# Altium schematic sheet Motor_Drive_2.SchDoc
size B; PageSetup: Record=PageOptions|CenterHorizontal=True|CenterVertical=True|PrintScale=1.09|XCorrection=1.00|YCorrection=1.00|PrintKind=1|BorderSize=5000000|LeftOffset=0|BottomOffset=0|Orientation=2|PaperLength=1000|PaperWidth=1000|Scale=100|PaperSource=261|PrintQuality=600|MediaType=1|DitherType=10|PaperKind=11x17|PrintScaleMode=1
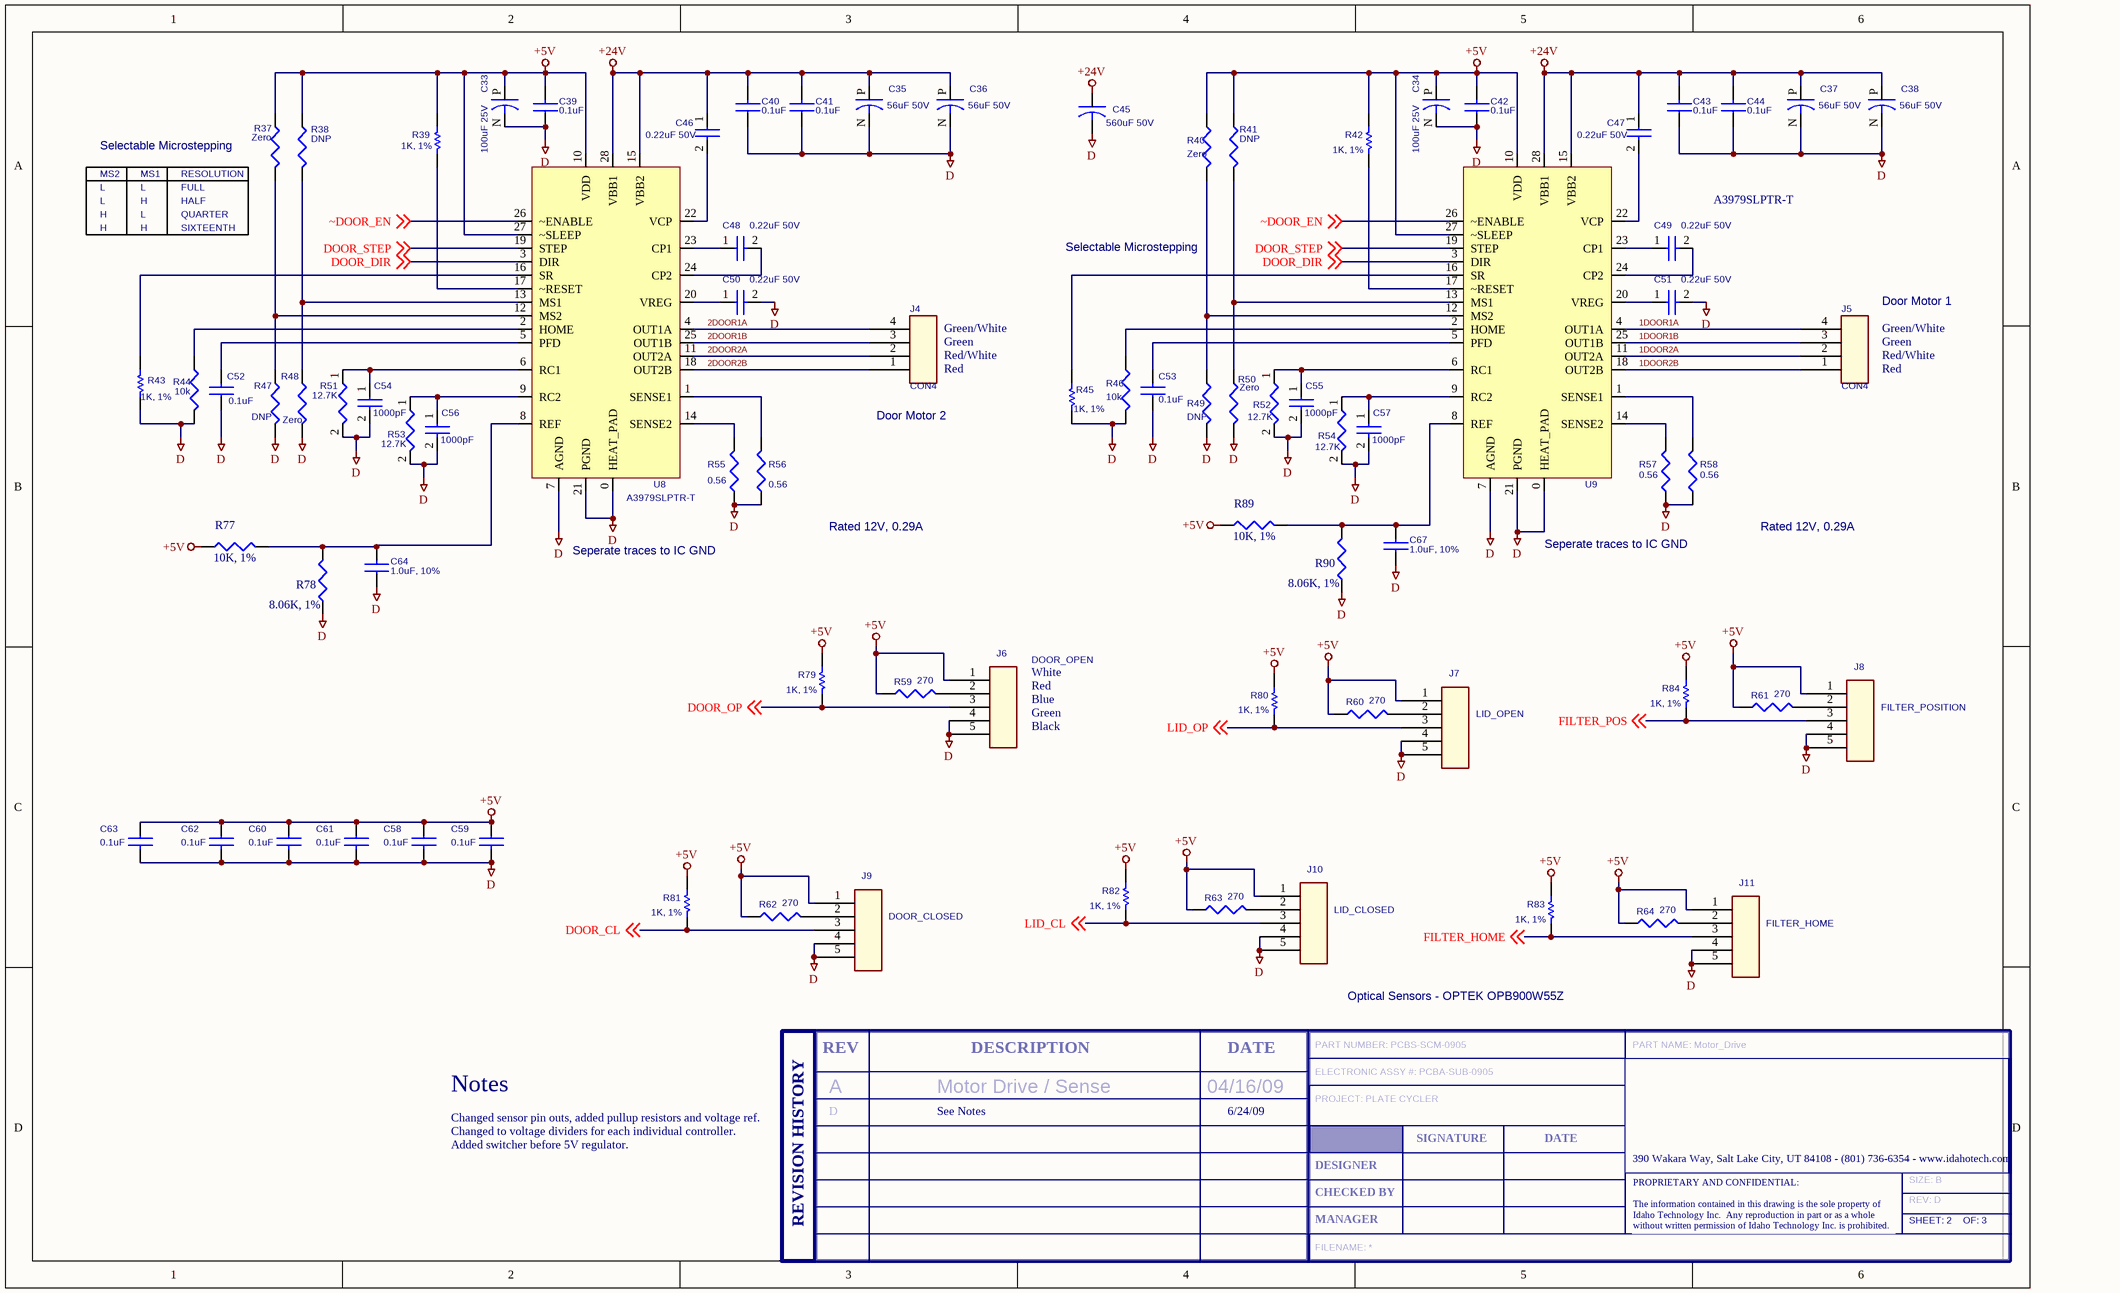
[diagram p0: Motor_Drive_2.SchDoc]

## Parts
C33  100uF 25V  [SM/CT_7360]
C34  100uF 25V  [SM/CT_7360]
C35  56uF 50V  [CPCYL/D.250/LS.100/.031]
C36  56uF 50V  [CPCYL/D.250/LS.100/.031]
C37  56uF 50V  [CPCYL/D.250/LS.100/.031]
C38  56uF 50V  [CPCYL/D.250/LS.100/.031]
C39  0.1uF  [SM/C_0603]
C40  0.1uF  [SM/C_0603]
C41  0.1uF  [SM/C_0603]
C42  0.1uF  [SM/C_0603]
C43  0.1uF  [SM/C_0603]
C44  0.1uF  [SM/C_0603]
C45  560uF 50V  [ELECT FS RADIAL 90, 25mm length x 12.5mm diameter - vertical]
C46  0.22uF 50V  [SM/C_0603]
C47  0.22uF 50V  [SM/C_0603]
C48  0.22uF 50V  [SM/C_0603]
C49  0.22uF 50V  [SM/C_0603]
C50  0.22uF 50V  [SM/C_0603]
C51  0.22uF 50V  [SM/C_0603]
C52  0.1uF  [SM/C_0603]
C53  0.1uF  [SM/C_0603]
C54  1000pF  [SM/C_0603]
C55  1000pF  [SM/C_0603]
C56  1000pF  [SM/C_0603]
C57  1000pF  [SM/C_0603]
C58  0.1uF  [SM/C_0603]
C59  0.1uF  [SM/C_0603]
C60  0.1uF  [SM/C_0603]
C61  0.1uF  [SM/C_0603]
C62  0.1uF  [SM/C_0603]
C63  0.1uF  [SM/C_0603]
C64  1.0uF, 10%  [SM/C_0603]
C67  1.0uF, 10%  [SM/C_0603]
J4  CON4  [MOLEX4]
J5  CON4  [MOLEX4]
J6  DOOR_OPEN  [POLCON.100/LOCKING/5]
J7  LID_OPEN  [POLCON.100/LOCKING/5]
J8  FILTER_POSITION  [POLCON.100/LOCKING/5]
J9  DOOR_CLOSED  [POLCON.100/LOCKING/5]
J10  LID_CLOSED  [POLCON.100/LOCKING/5]
J11  FILTER_HOME  [POLCON.100/LOCKING/5]
R37  Zero  [SM/R_0603]
R38  DNP  [SM/R_0603]  (no BOM)
R39  value 1K, 1%  [0603]  (hidden comment: Res1)
R40  Zero  [SM/R_0603]
R41  DNP  [SM/R_0603]  (no BOM)
R42  value 1K, 1%  [0603]  (hidden comment: Res1)
R43  value 1K, 1%  [0603]  (hidden comment: Res1)
R44  10k  [SM/R_0603]
R45  value 1K, 1%  [0603]  (hidden comment: Res1)
R46  10k  [SM/R_0603]
R47  DNP  [SM/R_0603]  (no BOM)
R48  Zero  [SM/R_0603]
R49  DNP  [SM/R_0603]  (no BOM)
R50  Zero  [SM/R_0603]
R51  12.7K  [SM/R_0603]
R52  12.7K  [SM/R_0603]
R53  12.7K  [SM/R_0603]
R54  12.7K  [SM/R_0603]
R55  0.56  [SM/R_2512]
R56  0.56  [SM/R_2512]
R57  0.56  [SM/R_2512]
R58  0.56  [SM/R_2512]
R59  270  [SM/R_0603]
R60  270  [SM/R_0603]
R61  270  [SM/R_0603]
R62  270  [SM/R_0603]
R63  270  [SM/R_0603]
R64  270  [SM/R_0603]
R77  10K, 1%  [SM/R_0603]
R78  8.06K, 1%  [SM/R_0603]
R79  value 1K, 1%  [0603]  (hidden comment: Res1)
R80  value 1K, 1%  [0603]  (hidden comment: Res1)
R81  value 1K, 1%  [0603]  (hidden comment: Res1)
R82  value 1K, 1%  [0603]  (hidden comment: Res1)
R83  value 1K, 1%  [0603]  (hidden comment: Res1)
R84  value 1K, 1%  [0603]  (hidden comment: Res1)
R89  10K, 1%  [SM/R_0603]
R90  8.06K, 1%  [SM/R_0603]
T??  SIZE: B  REV: D  PART NUMBER: PCBS-SCM-0905  PART NAME: Motor_Drive  ELECTRONIC ASSY #: PCBA-SUB-0905  PROJECT: PLATE CYCLER  SHEET: 2  OF: 3  (hidden comment: ITI Title Block, A Size)  (graphical)
U8  Manufacturer P/N: A3979SLPTR-T  [28-TSSOP_W_HEATPAD]  (hidden comment: STEPPER_CNTRL)
U9  Manufacturer P/N: A3979SLPTR-T  [28-TSSOP_W_HEATPAD]  (hidden comment: STEPPER_CNTRL)

## Nets
+5V: C33.P C34.P C39.2 C42.2 C58.1 C59.1 C60.1 C61.1 C62.1 C63.1 J6.1 J7.1 J8.1 J9.1 J10.1 J11.1 R37.1 R38.1 R39.2 R40.1 R41.1 R42.2 R59.1 R60.1 R61.1 R62.1 R63.1 R64.1 R77.1 R79.2 R80.2 R81.2 R82.2 R83.2 R84.2 R89.1 U8.10(VDD) U8.27(~SLEEP) U9.10(VDD) U9.27(~SLEEP)
+24V: C35.P C36.P C37.P C38.P C40.2 C41.2 C43.2 C44.2 C45.1 C46.1 C47.1 U8.15(VBB2) U8.28(VBB1) U9.15(VBB2) U9.28(VBB1)
D: C33.N C34.N C35.N C36.N C37.N C38.N C39.1 C40.1 C41.1 C42.1 C43.1 C44.1 C45.2 C50.2 C51.2 C52.1 C53.1 C54.2 C55.2 C56.2 C57.2 C58.2 C59.2 C60.2 C61.2 C62.2 C63.2 C64.1 C67.1 J6.4 J6.5 J7.4 J7.5 J8.4 J8.5 J9.4 J9.5 J10.4 J10.5 J11.4 J11.5 R43.1 R44.2 R45.1 R46.2 R47.2 R48.2 R49.2 R50.2 R51.2 R52.2 R53.2 R54.2 R55.1 R56.1 R57.1 R58.1 R78.1 R90.1 U8.0(HEAT_PAD) U8.7(AGND) U8.21(PGND) U9.0(HEAT_PAD) U9.7(AGND) U9.21(PGND)
1DOOR1A: J5.4 U9.4(OUT1A)
1DOOR1B: J5.3 U9.25(OUT1B)
1DOOR2A: J5.2 U9.11(OUT2A)
1DOOR2B: J5.1 U9.18(OUT2B)
2DOOR1A: J4.4 U8.4(OUT1A)
2DOOR1B: J4.3 U8.25(OUT1B)
2DOOR2A: J4.2 U8.11(OUT2A)
2DOOR2B: J4.1 U8.18(OUT2B)
DOOR_CL: J9.3 R81.1 ; off-sheet DOOR_CL
DOOR_DIR: U8.3(DIR) U9.3(DIR) ; off-sheet DOOR_DIR
DOOR_OP: J6.3 R79.1 ; off-sheet DOOR_OP
DOOR_STEP: U8.19(STEP) U9.19(STEP) ; off-sheet DOOR_STEP
FILTER_HOME: J11.3 R83.1 ; off-sheet FILTER_HOME
FILTER_POS: J8.3 R84.1 ; off-sheet FILTER_POS
LID_CL: J10.3 R82.1 ; off-sheet LID_CL
LID_OP: J7.3 R80.1 ; off-sheet LID_OP
~DOOR_EN: U8.26(~ENABLE) U9.26(~ENABLE) ; off-sheet ~DOOR_EN
NetC46_2: C46.2 U8.22(VCP)
NetC47_2: C47.2 U9.22(VCP)
NetC48_1: C48.1 U8.23(CP1)
NetC48_2: C48.2 U8.24(CP2)
NetC49_1: C49.1 U9.23(CP1)
NetC49_2: C49.2 U9.24(CP2)
NetC50_1: C50.1 U8.20(VREG)
NetC51_1: C51.1 U9.20(VREG)
NetC52_2: C52.2 U8.5(PFD)
NetC53_2: C53.2 U9.5(PFD)
NetC54_1: C54.1 R51.1 U8.6(RC1)
NetC55_1: C55.1 R52.1 U9.6(RC1)
NetC56_1: C56.1 R53.1 U8.9(RC2)
NetC57_1: C57.1 R54.1 U9.9(RC2)
NetC64_2: C64.2 R77.2 R78.2 U8.8(REF)
NetC67_2: C67.2 R89.2 R90.2 U9.8(REF)
NetJ6_2: J6.2 R59.2
NetJ7_2: J7.2 R60.2
NetJ8_2: J8.2 R61.2
NetJ9_2: J9.2 R62.2
NetJ10_2: J10.2 R63.2
NetJ11_2: J11.2 R64.2
NetR37_2: R37.2 R47.1 U8.12(MS2)
NetR38_2: R38.2 R48.1 U8.13(MS1)
NetR39_1: R39.1 U8.17(~RESET)
NetR40_2: R40.2 R49.1 U9.12(MS2)
NetR41_2: R41.2 R50.1 U9.13(MS1)
NetR42_1: R42.1 U9.17(~RESET)
NetR43_2: R43.2 U8.16(SR)
NetR44_1: R44.1 U8.2(HOME)
NetR45_2: R45.2 U9.16(SR)
NetR46_1: R46.1 U9.2(HOME)
NetR55_2: R55.2 U8.14(SENSE2)
NetR56_2: R56.2 U8.1(SENSE1)
NetR57_2: R57.2 U9.14(SENSE2)
NetR58_2: R58.2 U9.1(SENSE1)

## Notes on the sheet
- (near R37) Selectable Microstepping
- MS2
- L
- H
- MS1
- RESOLUTION
- FULL
- HALF
- QUARTER
- SIXTEENTH
- Selectable Microstepping
- (near J4) Red
- (near J4) Red/White
- (near J4) Green
- (near J4) Green/White
- (near J5) Door Motor 1
- (near J5) Red
- (near J5) Red/White
- (near J5) Green
- (near J5) Green/White
- (near J4) Door Motor 2
- Seperate traces to IC GND
- Rated 12V, 0.29A
- (near J6) White
- (near J6) Red
- (near J6) Blue
- (near J6) Green
- (near J6) Black
- Optical Sensors - OPTEK OPB900W55Z
- Notes
- A
- Motor Drive / Sense
- 04/16/09
- Changed sensor pin outs, added pullup resistors and voltage ref.
- Changed to voltage dividers for each individual controller.
- Added switcher before 5V regulator.
- D
- See Notes
- 6/24/09
- (in symbol ITI A-size Title Block and Rev Table) REV; DESCRIPTION; DATE; SIGNATURE; 390 Wakara Way, Salt Lake City, UT 84108 - (801) 736-6354 - www.idahotech.com; DESIGNER; CHECKED BY; REVISION HISTORY; MANAGER; PROPRIETARY AND CONFIDENTIAL: / The information contained in this drawing is the sole property of / Idaho Technology Inc.  Any reproduction in part or as a whole / without written permission of Idaho Technology Inc. is prohibited.

## Library data of the parts
C33 C34 = CAP_1: CAPACITOR TANT 100UF 25V 20% SMD; Manufacturer: Kemet; Manufacturer P/N: T510E107M025AT E050; Vendor: Digikey; Vendor P/N: 399-3989-1-ND
C35-C38 = CAP_1: CAP 56UF 50V ELECT FC RADIAL; Manufacturer: PANASONIC; Manufacturer P/N: EEU-FC1H560; Vendor P/N: P10322-ND; Vendor: Digikey
C39-C44 C52 C53 = CAP NP_Dup1: CAP CER .10UF 50V X7R 0603; Manufacturer: Taiyo Yuden; Manufacturer P/N: UMK107B7104KA-T; Vendor: Digikey; Vendor P/N: 587-1243-1-ND
C45 = CAP: CAP 560UF 50V ELECT FC RADIAL; Manufacturer P/N: EEU-FC1H561; Manufacturer: Panasonic; Vendor P/N: P11261-ND; Vendor: Digikey
C46-C51 = CAP NP_1: CAP CER .22UF 50V Y5V 0603; Manufacturer: Murata Electronics North America; Manufacturer P/N: GRM188F51H224ZA01D; Vendor P/N: 490-1569-1-ND; Vendor: Digikey
C54-C57 = CAP NP_1: CAP 1000PF 50V CERAMIC X7R 0603; Manufacturer: Panasonic - ECG; Manufacturer P/N: ECJ-1VB1H102K; Vendor P/N: PCC1772CT-ND; Vendor: Digikey
C58-C63 = CAP NP_Dup1: CAP CER .10UF 50V X7R 0603; Manufacturer P/N: UMK107B7104KA-T; Manufacturer: Taiyo Yuden; Vendor P/N: 587-1243-1-ND; Vendor: Digikey
C64 C67 = CAP NP_Dup1: CAP CER 1.0UF 10V X5R 10% 0603; Manufacturer: TDK Corporation; Manufacturer P/N: C1608X5R1A105K; Vendor: DIGIKEY; Vendor P/N: 445-1321-1-ND
J4 J5 = CON4: CONN HEADER 4POS .100 VERT GOLD; Manufacturer: Molex/Waldom Electronics Corp; Manufacturer P/N: 70543-0003; Vendor P/N: WM4802-ND; Vendor: Digikey
J6-J11 = CON5: CONN HEADER 5POS .100 VERT GOLD; Manufacturer: Molex; Manufacturer P/N: 70543-0004; Vendor: Digikey; Vendor P/N: WM4803-ND
R37 R38 R40 R41 R47-R50 = R: RES 0.0 OHM 1/10W 5% 0603 SMD; Manufacturer P/N: MCR03EZPJ000; Manufacturer: ROHM SEMICONDUCTOR; Vendor P/N: RHM0.0GCT-ND; Vendor: DIGIKEY; Price: 0.069
R39 R43 R45 R79-R81 = Res1: RES 1.00K OHM 1/10W 1% 0603 SMD; Manufacturer: PANASONIC - ECG; Manufacturer P/N: ERJ-3EKF1001V; Vendor: DIGIKEY; Vendor P/N: P1.00KHCT-ND; IT P/N: N/A; Price: 0.73
R42 R82-R84 = Res1: RES 1.00K OHM 1/10W 1% 0603 SMD; Manufacturer: PANASONIC; Manufacturer P/N: ERJ-3EKF1001V; Vendor: DIGIKEY; Vendor P/N: P1.00KHCT-ND; IT P/N: N/A; Price: 0.73
R44 R46 = R: RES 10K OHM 1/10W 5% 0603 SMD; Manufacturer P/N: ERJ-3GEYJ103V; Manufacturer: Panasonic; Vendor P/N: P10KGCT-ND; Vendor: Digikey
R51-R54 = RESISTOR_0_Dup1: RES 12.7K OHM 1/10W 1% 0603 SMD; Manufacturer P/N: ERJ-3EKF1272V; Manufacturer: Panasonic; Vendor P/N: P12.7KHCT-ND; Vendor: Digikey
R55-R58 = RESISTOR: RES .56 OHM 1W 1% 2512 SMD; Manufacturer P/N: ERJ-1TRQFR56U; Manufacturer: Panasonic; Vendor P/N: PT.56YCT-ND; Vendor: Digikey
R59-R64 = R: RES 270 OHM 1/10W 5% 0603 SMD; Manufacturer: Panasonic; Manufacturer P/N: ERJ-3GEYJ271V; Vendor: Digikey; Vendor P/N: P270GCT-ND
R77 R89 = Res3: RES 10.0K OHM 1/10W 1% 0603 SMD; Manufacturer: Panasonic; Manufacturer P/N: ERJ-3EKF1002V; Vendor: Digikey; Vendor P/N: P10.0KHCT-ND
R78 R90 = Res3: RES 8.06K OHM 1/10W 1% 0603 SMD; Manufacturer: Panasonic; Manufacturer P/N: ERJ-3EKF8061V; Vendor: Digikey; Vendor P/N: P8.06KHCT-ND; Price: 0.73
T?? = ITI A-size Title Block and Rev Table: ITI Title Block and Rev Table, A Size; FILENAME: *
U8 U9 = STEPPER_CNTRL: IC DRIVER MICROSTEPPING 28-TSSOP; Manufacturer: ALLEGRO; Vendor P/N: 620-1148-1-ND; Vendor: DIGIKEY